# Altium project eeg.PrjPcb
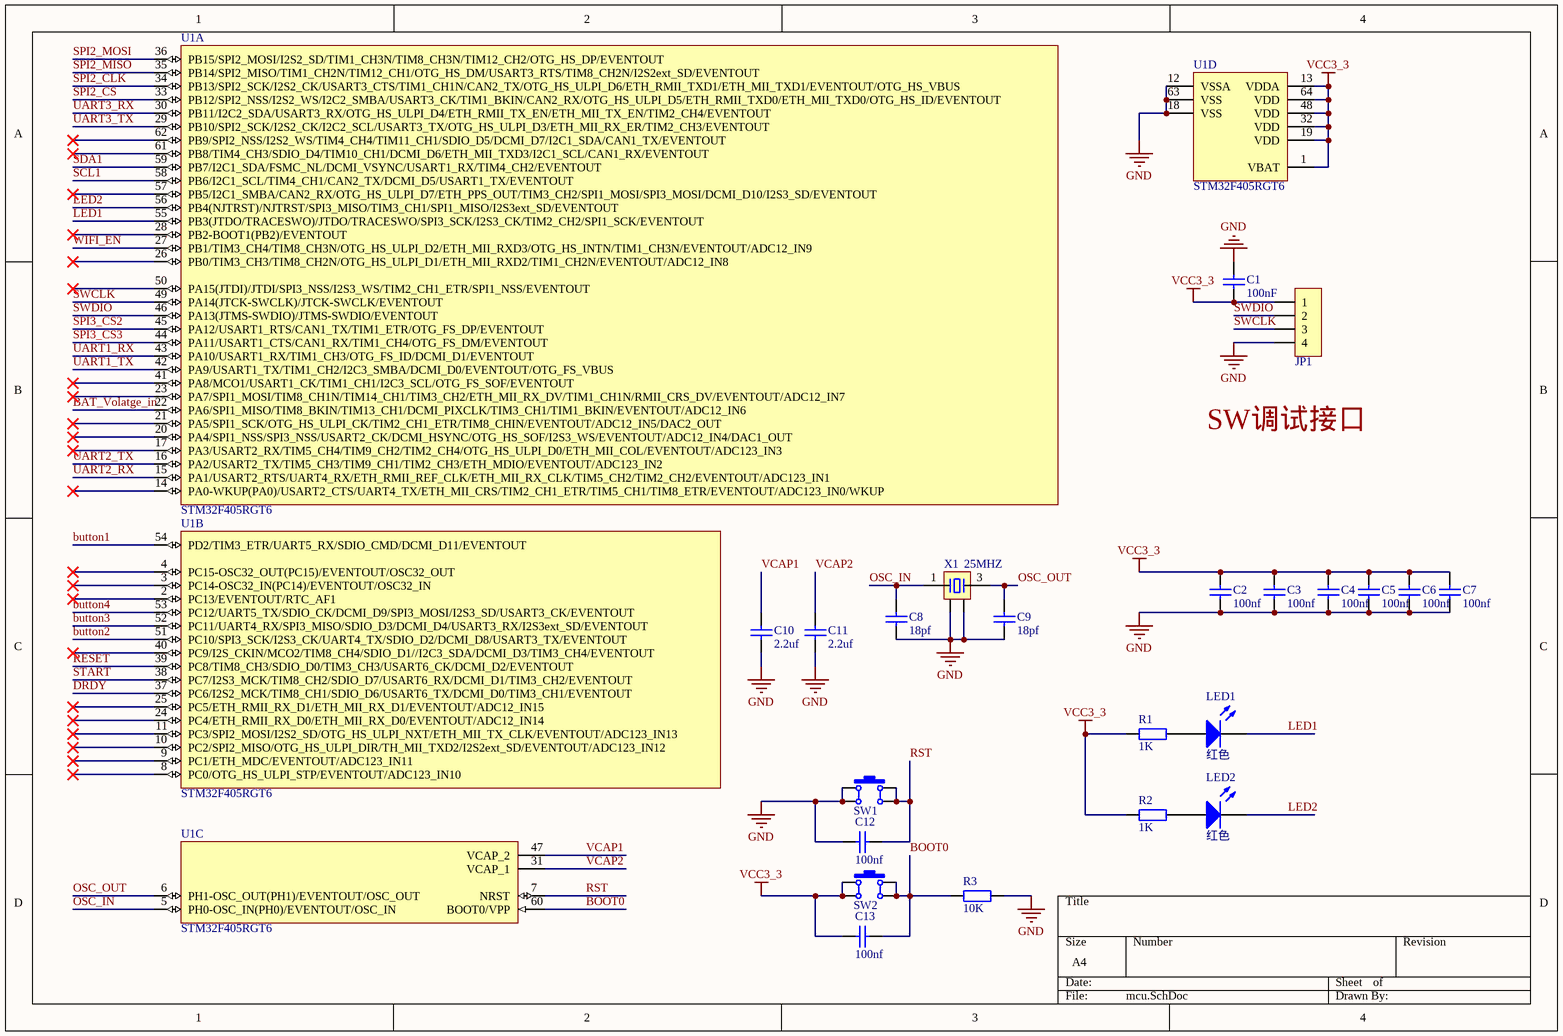
[diagram p0: mcu.SchDoc]
3 sheets, 86 parts. Net scope: global (net labels, ports and power ports of the same name join across sheets).
Board file: eeg.PcbDoc
Sheets:
  mcu.SchDoc
  power_battery.SchDoc
  communication.SchDoc

## Sheet mcu.SchDoc
size A4; SheetNumber: 1; SheetTotal: 4

### Parts
C1  100nF  [C0603_L]
C2  100nf  [C0402_L]
C3  100nf  [C0402_L]
C4  100nf  [C0402_L]
C5  100nf  [C0402_L]
C6  100nf  [C0402_L]
C7  100nf  [C0402_L]
C8  18pf  [C0402_L]
C9  18pf  [C0402_L]
C10  2.2uf  [C0402_L]
C11  2.2uf  [C0402_L]
C12  100nf  [C0603_L]
C13  100nf  [C0603_L]
JP1  HDR-1X4  [XH2.54-WI-4P]  (value not drawn)
LED1  红色  [LED0603_Y]
LED2  红色  [LED0603_Y]
R1  1K  [R0603_L]
R2  1K  [R0603_L]
R3  10K  [R0603_L]
SW1  3*4*2.5  [SW-SMD-4.2x3.2_4P]  (value not drawn)
SW2  3*4*2.5  [SW-SMD-4.2x3.2_4P]  (value not drawn)
U1  STM32F405RGT6  [TQFP64_V]  (parts A,B,C,D of 4)
X1  25MHZ  [XTAL-3225-4P]

### Nets
GND: C1.2 C2.1 C3.1 C4.1 C5.1 C6.1 C7.1 C8.1 C9.1 C10.1 C11.1 C12.2 JP1.4 R3.2 SW1.1 SW1.4 U1.12(VSSA) U1.18(VSS) U1.63(VSS) X1.2 X1.4
VCC3_3: C1.1 C2.2 C3.2 C4.2 C5.2 C6.2 C7.2 C13.2 JP1.1 R1.1 R2.1 SW2.1 SW2.4 U1.1(VBAT) U1.13(VDDA) U1.19(VDD) U1.32(VDD) U1.48(VDD) U1.64(VDD)
BAT_Volatge_in: U1.22(PA6/SPI1_MISO/TIM8_BKIN/TIM13_CH1/DCMI_PIXCLK/TIM3_CH1/TIM1_BKIN/EVENTOUT/ADC12_IN6)
BOOT0: C13.1 R3.1 SW2.2 SW2.3 U1.60(BOOT0/VPP)
button1: U1.54(PD2/TIM3_ETR/UART5_RX/SDIO_CMD/DCMI_D11/EVENTOUT)
button2: U1.51(PC10/SPI3_SCK/I2S3_CK/UART4_TX/SDIO_D2/DCMI_D8/USART3_TX/EVENTOUT)
button3: U1.52(PC11/UART4_RX/SPI3_MISO/SDIO_D3/DCMI_D4/USART3_RX/I2S3ext_SD/EVENTOUT)
button4: U1.53(PC12/UART5_TX/SDIO_CK/DCMI_D9/SPI3_MOSI/I2S3_SD/USART3_CK/EVENTOUT)
DRDY: U1.37(PC6/I2S2_MCK/TIM8_CH1/SDIO_D6/USART6_TX/DCMI_D0/TIM3_CH1/EVENTOUT)
LED1: LED1.2(K) U1.55(PB3(JTDO/TRACESWO)/JTDO/TRACESWO/SPI3_SCK/I2S3_CK/TIM2_CH2/SPI1_SCK/EVENTOUT)
LED2: LED2.2(K) U1.56(PB4(NJTRST)/NJTRST/SPI3_MISO/TIM3_CH1/SPI1_MISO/I2S3ext_SD/EVENTOUT)
OSC_IN: C8.2 U1.5(PH0-OSC_IN(PH0)/EVENTOUT/OSC_IN) X1.1
OSC_OUT: C9.2 U1.6(PH1-OSC_OUT(PH1)/EVENTOUT/OSC_OUT) X1.3
RESET: U1.39(PC8/TIM8_CH3/SDIO_D0/TIM3_CH3/USART6_CK/DCMI_D2/EVENTOUT)
RST: C12.1 SW1.2 SW1.3 U1.7(NRST)
SCL1: U1.58(PB6/I2C1_SCL/TIM4_CH1/CAN2_TX/DCMI_D5/USART1_TX/EVENTOUT)
SDA1: U1.59(PB7/I2C1_SDA/FSMC_NL/DCMI_VSYNC/USART1_RX/TIM4_CH2/EVENTOUT)
SPI2_CLK: U1.34(PB13/SPI2_SCK/I2S2_CK/USART3_CTS/TIM1_CH1N/CAN2_TX/OTG_HS_ULPI_D6/ETH_RMII_TXD1/ETH_MII_TXD1/EVENTOUT/OTG_HS_VBUS)
SPI2_CS: U1.33(PB12/SPI2_NSS/I2S2_WS/I2C2_SMBA/USART3_CK/TIM1_BKIN/CAN2_RX/OTG_HS_ULPI_D5/ETH_RMII_TXD0/ETH_MII_TXD0/OTG_HS_ID/EVENTOUT)
SPI2_MISO: U1.35(PB14/SPI2_MISO/TIM1_CH2N/TIM12_CH1/OTG_HS_DM/USART3_RTS/TIM8_CH2N/I2S2ext_SD/EVENTOUT)
SPI2_MOSI: U1.36(PB15/SPI2_MOSI/I2S2_SD/TIM1_CH3N/TIM8_CH3N/TIM12_CH2/OTG_HS_DP/EVENTOUT)
SPI3_CS2: U1.45(PA12/USART1_RTS/CAN1_TX/TIM1_ETR/OTG_FS_DP/EVENTOUT)
SPI3_CS3: U1.44(PA11/USART1_CTS/CAN1_RX/TIM1_CH4/OTG_FS_DM/EVENTOUT)
START: U1.38(PC7/I2S3_MCK/TIM8_CH2/SDIO_D7/USART6_RX/DCMI_D1/TIM3_CH2/EVENTOUT)
SWCLK: JP1.3 U1.49(PA14(JTCK-SWCLK)/JTCK-SWCLK/EVENTOUT)
SWDIO: JP1.2 U1.46(PA13(JTMS-SWDIO)/JTMS-SWDIO/EVENTOUT)
UART1_RX: U1.43(PA10/USART1_RX/TIM1_CH3/OTG_FS_ID/DCMI_D1/EVENTOUT)
UART1_TX: U1.42(PA9/USART1_TX/TIM1_CH2/I2C3_SMBA/DCMI_D0/EVENTOUT/OTG_FS_VBUS)
UART2_RX: U1.15(PA1/USART2_RTS/UART4_RX/ETH_RMII_REF_CLK/ETH_MII_RX_CLK/TIM5_CH2/TIM2_CH2/EVENTOUT/ADC123_IN1)
UART2_TX: U1.16(PA2/USART2_TX/TIM5_CH3/TIM9_CH1/TIM2_CH3/ETH_MDIO/EVENTOUT/ADC123_IN2)
UART3_RX: U1.30(PB11/I2C2_SDA/USART3_RX/OTG_HS_ULPI_D4/ETH_RMII_TX_EN/ETH_MII_TX_EN/TIM2_CH4/EVENTOUT)
UART3_TX: U1.29(PB10/SPI2_SCK/I2S2_CK/I2C2_SCL/USART3_TX/OTG_HS_ULPI_D3/ETH_MII_RX_ER/TIM2_CH3/EVENTOUT)
VCAP1: C10.2 U1.47(VCAP_2)
VCAP2: C11.2 U1.31(VCAP_1)
WIFI_EN: U1.27(PB1/TIM3_CH4/TIM8_CH3N/OTG_HS_ULPI_D2/ETH_MII_RXD3/OTG_HS_INTN/TIM1_CH3N/EVENTOUT/ADC12_IN9)
NetLED1_1: LED1.1(A) R1.2
NetLED2_1: LED2.1(A) R2.2

Not connected (* = marked no-connect by the designer): U1 2(PC13/EVENTOUT/RTC_AF1)* 3(PC14-OSC32_IN(PC14)/EVENTOUT/OSC32_IN)* 4(PC15-OSC32_OUT(PC15)/EVENTOUT/OSC32_OUT)* 8(PC0/OTG_HS_ULPI_STP/EVENTOUT/ADC123_IN10)* 9(PC1/ETH_MDC/EVENTOUT/ADC123_IN11)* 10(PC2/SPI2_MISO/OTG_HS_ULPI_DIR/TH_MII_TXD2/I2S2ext_SD/EVENTOUT/ADC123_IN12)* 11(PC3/SPI2_MOSI/I2S2_SD/OTG_HS_ULPI_NXT/ETH_MII_TX_CLK/EVENTOUT/ADC123_IN13)* 14(PA0-WKUP(PA0)/USART2_CTS/UART4_TX/ETH_MII_CRS/TIM2_CH1_ETR/TIM5_CH1/TIM8_ETR/EVENTOUT/ADC123_IN0/WKUP)* 17(PA3/USART2_RX/TIM5_CH4/TIM9_CH2/TIM2_CH4/OTG_HS_ULPI_D0/ETH_MII_COL/EVENTOUT/ADC123_IN3)* 20(PA4/SPI1_NSS/SPI3_NSS/USART2_CK/DCMI_HSYNC/OTG_HS_SOF/I2S3_WS/EVENTOUT/ADC12_IN4/DAC1_OUT)* 21(PA5/SPI1_SCK/OTG_HS_ULPI_CK/TIM2_CH1_ETR/TIM8_CHIN/EVENTOUT/ADC12_IN5/DAC2_OUT)* 23(PA7/SPI1_MOSI/TIM8_CH1N/TIM14_CH1/TIM3_CH2/ETH_MII_RX_DV/TIM1_CH1N/RMII_CRS_DV/EVENTOUT/ADC12_IN7)* 24(PC4/ETH_RMII_RX_D0/ETH_MII_RX_D0/EVENTOUT/ADC12_IN14)* 25(PC5/ETH_RMII_RX_D1/ETH_MII_RX_D1/EVENTOUT/ADC12_IN15)* 26(PB0/TIM3_CH3/TIM8_CH2N/OTG_HS_ULPI_D1/ETH_MII_RXD2/TIM1_CH2N/EVENTOUT/ADC12_IN8)* 28(PB2-BOOT1(PB2)/EVENTOUT)* 40(PC9/I2S_CKIN/MCO2/TIM8_CH4/SDIO_D1//I2C3_SDA/DCMI_D3/TIM3_CH4/EVENTOUT)* 41(PA8/MCO1/USART1_CK/TIM1_CH1/I2C3_SCL/OTG_FS_SOF/EVENTOUT)* 50(PA15(JTDI)/JTDI/SPI3_NSS/I2S3_WS/TIM2_CH1_ETR/SPI1_NSS/EVENTOUT)* 57(PB5/I2C1_SMBA/CAN2_RX/OTG_HS_ULPI_D7/ETH_PPS_OUT/TIM3_CH2/SPI1_MOSI/SPI3_MOSI/DCMI_D10/I2S3_SD/EVENTOUT)* 61(PB8/TIM4_CH3/SDIO_D4/TIM10_CH1/DCMI_D6/ETH_MII_TXD3/I2C1_SCL/CAN1_RX/EVENTOUT)* 62(PB9/SPI2_NSS/I2S2_WS/TIM4_CH4/TIM11_CH1/SDIO_D5/DCMI_D7/I2C1_SDA/CAN1_TX/EVENTOUT)*

### Notes on the sheet
- SW调试接口

### Library data of the parts
C1-C13 = C: 贴片电容/MLCC电容; BOM名称: 无极性贴片电容; 联系下单店铺卖家 免费帮你查找封装: 联系下单店铺卖家 免费技术指导
JP1 = Header 4: 4P接插件; 联系卖家，免费查找封装: 唯一出售店铺网址https://shop463601444.taobao.com; 封装库来自淘宝卖家ID：黄晶宝石: 其他店铺购入均为盗版封装库，请立即申请退款，本店现金奖励50~200元; BOM名称: 4P接插件
LED1 LED2 = LED: 贴片LED; 封装库来自淘宝卖家：黄晶宝石: 其他店铺购入均为盗版封装库，无更新权益，请立即申请退款，本店现金奖励200~1000元; BOM名称: 贴片LED
R1-R3 = R: 贴片电阻; 联系下单店铺卖家 免费帮你查找封装: 联系下单店铺卖家 免费技术指导; BOM名称: 贴片电阻
SW1 SW2 = SW SMD-3*4*2.5: 贴片4脚轻触开关; 联系下单店铺卖家 免费技术支持: 联系下单店铺卖家 免费帮你查找封装
U1 = STM32F405RGT6: ARM Cortex-M4 32b MCU+FPU, 210DMIP, 1024 kB Flash, 192+4 kB RAM, 51 I/Os, 64-pin LQFP, -40 to +85癈, Tray; Internal RAM: 192kB; Operating Frequency (Processor Speed): 168MHz; A/D Converter: 16x12-bit; D/A Converter: 2x12-bit; 16-bit Timers (IC/OC/PWM): 12x16-bit(24/24/30); 32-bit Timer (IC/OC/PWM): 2x32-bit (8/8/8); Other Timer Functions: 2xWDG, RTC, 24-bit down counter; Serial Interface: 3xSPI/2xI2S/2xI2C/3xUSART(IrDa, ISO7816)/3xUART/1xUSB OTG FS/HS, 2xCAN/ SDIO; 当前库版本V2023.3.12 @淘宝卖家:黄晶宝石: 最新版本发布https://item.taobao.com/item.htm?id=566775463719; DatasheetVersion: rev2, Jan-2012; PackageVersion: 2012; PackageReference: TQFP64; PackageDescription: 64-Pin Low Profile Quad Flat Package, 10x10 mm Body, 0.5 mm Pitch; ComponentLink1Description: Manufacturer URL; ComponentLink1URL: http://www.st.com/; ComponentLink2Description: STM32F405/7 Datasheet; ComponentLink2URL: http://www.st.com/internet/com/TECHNICAL_RESOURCES/TECHNICAL_LITERATURE/DATASHEET/DM00037051.pdf; ComponentLink3Description: STM32F4 Web Page; ComponentLink3URL: http://www.st.com/internet/mcu/subclass/1521.jsp
X1 = XTAL-4P: 4脚无源晶振(谐振器）C9006; 联系下单店铺卖家 免费帮你查找封装: 联系下单店铺卖家 免费技术指导; BOM名称: 4脚无源晶振(谐振器）; jlc_id: C9006

## Sheet power_battery.SchDoc
size A4; SheetNumber: 3; SheetTotal: 4
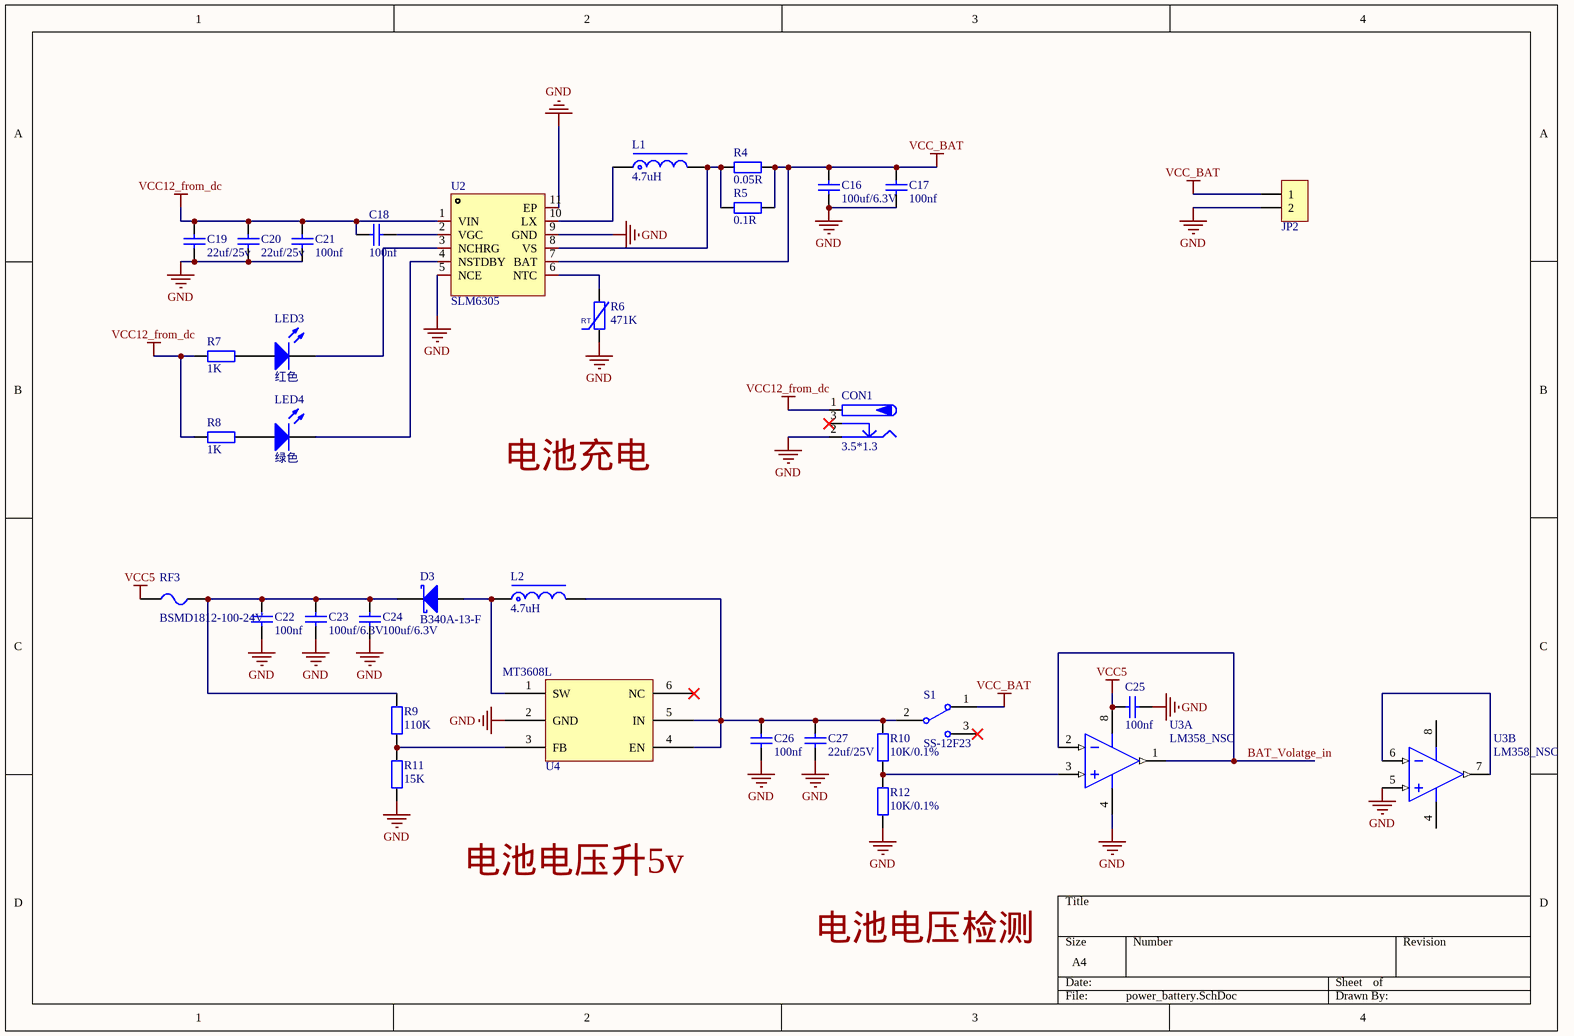
[diagram p1: power_battery.SchDoc]

### Parts
C16  100uf/6.3V  [C1206_L]
C17  100nf  [C0603_L]
C18  100nf  [C0603_L]
C19  22uf/25v  [C0805_L]
C20  22uf/25v  [C0805_L]
C21  100nf  [C0603_L]
C22  100nf  [C0603_L]
C23  100uf/6.3V  [C1206_L]
C24  100uf/6.3V  [C1206_L]
C25  100nf  [C0603_L]
C26  100nf  [C0603_L]
C27  22uf/25V  [C1206_L]
CON1  3.5*1.3  [DC-005]
D3  B340A-13-F  [SMA]
JP2  HDR-1X2  [PH2.0-L-2P]  (value not drawn)
L1  4.7uH  [CD53]
L2  4.7uH  [CD53]
LED3  红色  [LED0603_Y]
LED4  绿色  [LED0603_Y]
R4  0.05R  [R0805_M]
R5  0.1R  [R0805_M]
R6  471K  [PK0406]
R7  1K  [R0603_L]
R8  1K  [R0603_L]
R9  110K  [R0603_L]
R10  10K/0.1%  [R0603_L]
R11  15K  [R0603_L]
R12  10K/0.1%  [R0603_L]
RF3  BSMD1812-100-24V  [F1812]
S1  SS-12F23  [SS-12D10]
U2  SLM6305  [DFN10-L3.0-W3.0-P0.5_EP]
U3  LM358_NSC  [SOP8_N]  (parts A,B of 2)
U4  MT3608L  [SOT23-6M]

### Nets
GND: C16.1 C17.1 C19.1 C20.1 C21.2 C22.1 C23.1 C24.1 C25.1 C26.1 C27.1 CON1.2 JP2.2 R6.1 R11.1 R12.1 U2.5(NCE) U2.9(GND) U2.11(EP) U3.4(V-) U3.5(IN2+) U4.2(GND)
VCC5: C25.2 RF3.2 U3.8(V+)
VCC12_from_dc: C18.2 C19.2 C20.2 C21.1 CON1.1 R7.1 R8.1 U2.1(VIN)
VCC_BAT: C16.2 C17.2 JP2.1 R4.2 R5.2 S1.1 U2.7(BAT)
BAT_Volatge_in: U3.1(OUT1) U3.2(IN1-)
NetC18_1: C18.1 U2.2(VGC)
NetC22_2: C22.2 C23.2 C24.2 D3.2(K) R9.2 RF3.1
NetC26_2: C26.2 C27.2 L2.2 R10.2 S1.2 U4.4(EN) U4.5(IN)
NetD3_1: D3.1(A) L2.1 U4.1(SW)
NetL1_1: L1.1 U2.10(LX)
NetL1_2: L1.2 R4.1 R5.1 U2.8(VS)
NetLED3_1: LED3.1(A) R7.2
NetLED3_2: LED3.2(K) U2.3(NCHRG)
NetLED4_1: LED4.1(A) R8.2
NetLED4_2: LED4.2(K) U2.4(NSTDBY)
NetR6_2: R6.2 U2.6(NTC)
NetR9_1: R9.1 R11.2 U4.3(FB)
NetR10_1: R10.1 R12.2 U3.3(IN1+)
NetU3_6: U3.6(IN2-) U3.7(OUT2)

Not connected (* = marked no-connect by the designer): CON1 3*; S1 3*; U4 6(NC)*

### Notes on the sheet
- 电池充电
- 电池电压升5v
- 电池电压检测

### Library data of the parts
C16-C21 = C: as C1 on sheet mcu
  C16 C19 C20: jlc_id: C45783
C22-C27 = C: 贴片电容/MLCC电容; BOM名称: 无极性贴片电容
  C23 C24: jlc_id: C15008
CON1 = DC002~DC005: 低压DC电源接口; BOM名称: DC电源接口; 当前库版本V2024.2.3 @淘宝卖家:黄晶宝石: 最新版本发布https://item.taobao.com/item.htm?id=566775463719
D3 = B340A-13-F: 肖特基二极管 C85098; 属性: 60V/5A; BOM名称: 肖特基二极管
JP2 = Header 2: 2P接插件; 封装库来自淘宝卖家：黄晶宝石: 获取最新版本https://shop463601444.taobao.com; 联系下单店铺卖家 免费帮你查找封装: 联系下单店铺卖家 免费技术支持; BOM名称: 2P接插件
L1 L2 = L-SMD: CD系列贴片线绕功率电感; BOM名称: 功率电感; jlc_id: C177246
LED3 LED4 = LED: as LED1 on sheet mcu; BOM名称: 贴片LED
R4 R5 R7-R12 = R: 贴片电阻; 联系下单店铺卖家 免费帮你查找封装: 联系下单店铺卖家 免费技术指导; BOM名称: 贴片电阻
  R4: jlc_id: C127691
  R5: jlc_id: C25334
R6 = RT: 热敏电阻; BOM名称: 压敏电阻; 当前库版本V2024.3.30 @淘宝卖家:黄晶宝石: 最新版本发布https://item.taobao.com/item.htm?id=566775463719
RF3 = FUSE-PPTC: PPTC自恢复保险丝 C910830; 当前库版本V2024.3.30 @淘宝卖家:黄晶宝石: 最新版本发布https://item.taobao.com/item.htm?id=566775463719; BOM名称: PPTC自恢复保险丝; jlc_id: C883154
S1 = SSW-1P: 1路波动开关; BOM名称: 波动开关; 联系下单店铺卖家 免费技术支持: 联系下单店铺卖家 免费帮你查找封装
U2 = SLM6305: 1锂电池充电ic 2.5a 4.2v 4V~26V输入; Manufacturer: 无锡松朗微; Add into BOM: yes; The Chip Type: 降压充电芯片; Supply Voltage: 4V~26V; Type of Battery: 锂离子/聚合物; Number of Cells: 1; Symbol: SLM6305; Device: SLM6305; Supplier: LCSC; jlc_id: C711584; Manufacturer Part: SLM6305; JLCPCB Part Class: 扩展库; LCSC Part Name: 宽输入电压2.5A单节锂电池充电管理IC; Supplier Footprint: TDFN-10-EP(3x3); Datasheet: https://atta.szlcsc.com/upload/public/pdf/source/20200723/C711584_2224278DBAF55B7B34A102BEBD70C238.pdf; Convert to PCB: yes; Maximum Charge Current: 2.5A; Charging Saturation Voltage: 4.2V; Operating Temperature: -40℃~+85℃
U3 = LM358_NSC: Fast Settling Dual Operational Amplifier; 联系卖家 免费查找封装: 唯一出售店铺网址https://shop463601444.taobao.com; jlc_id: C2923376
U4 = MT3608L: Boost升压DC-DC芯片 2-28V

## Sheet communication.SchDoc
size A4; SheetNumber: 4; SheetTotal: 4
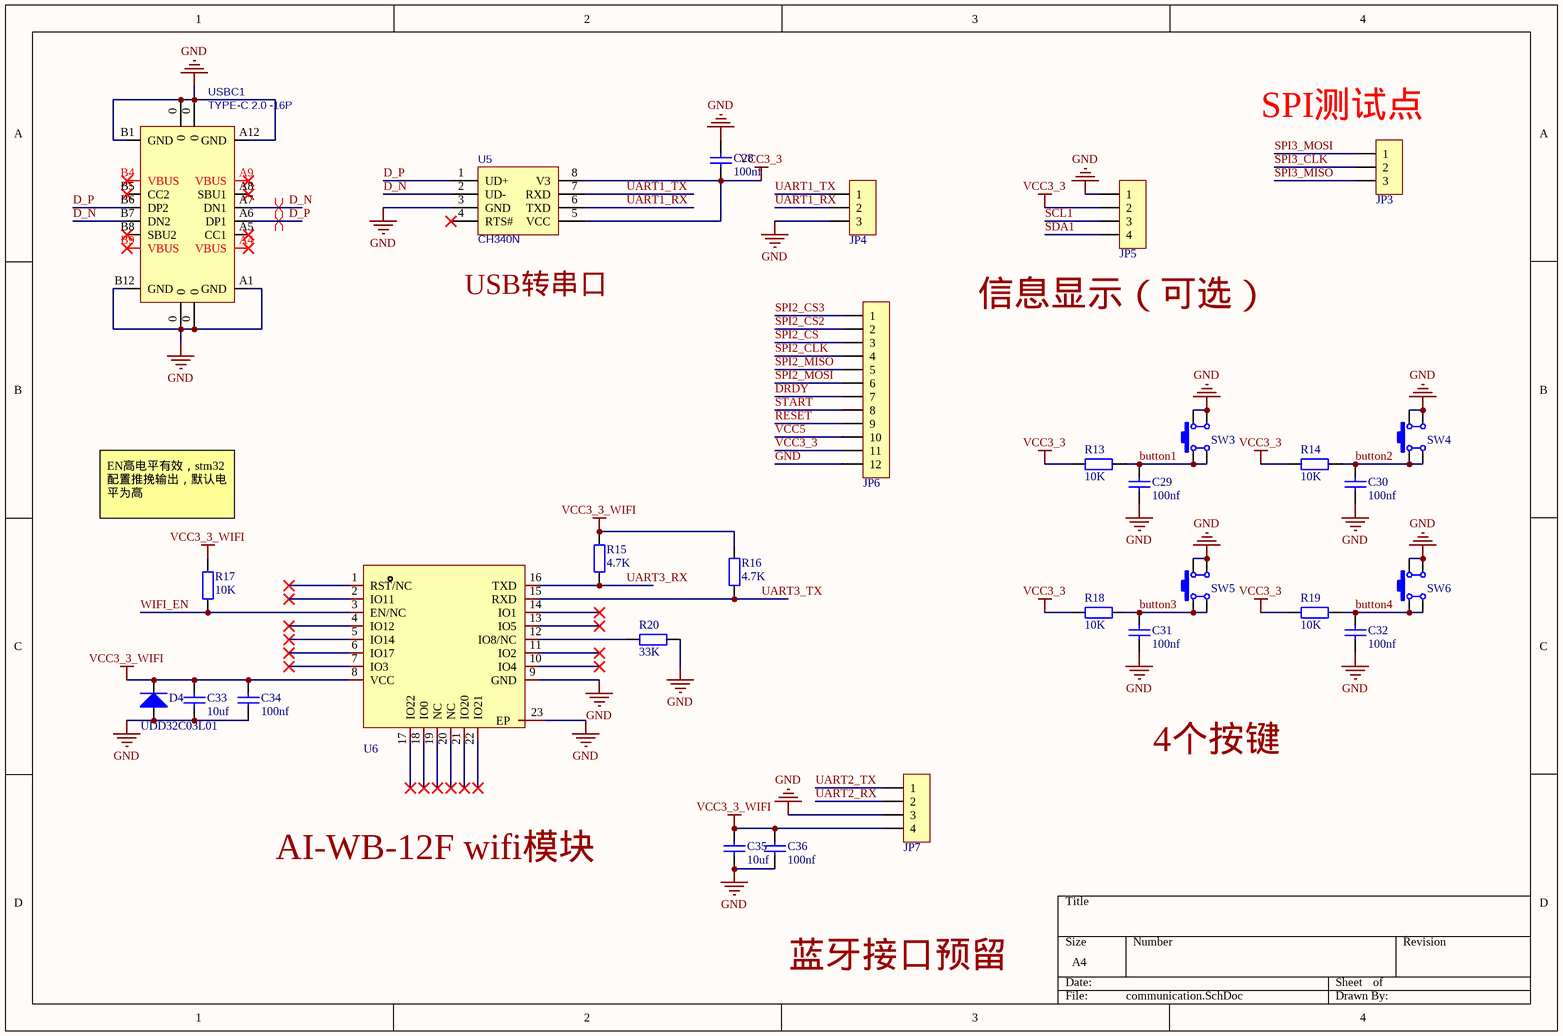
[diagram p2: communication.SchDoc]

### Parts
C28  100nf  [C0603_L]
C29  100nf  [C0603_L]
C30  100nf  [C0603_L]
C31  100nf  [C0603_L]
C32  100nf  [C0603_L]
C33  10uf  [C0603_L]
C34  100nf  [C0603_L]
C35  10uf  [C0603_L]
C36  100nf  [C0603_L]
D4  UDD32C03L01  [SOD-323]
JP3  HDR-1X3  [HDR2.54-LI-3P]  (value not drawn)
JP4  HDR-1X3  [HDR2.54-LI-3P]  (value not drawn)
JP5  HDR-1X4  [HDR2.54-M-LI-4P]  (value not drawn)
JP6  HDR-1X12  [HDR2.54-M-LI-12P]  (value not drawn)
JP7  HDR-1X4  [HDR2.54-M-LI-4P]  (value not drawn)
R13  10K  [R0603_L]
R14  10K  [R0603_L]
R15  4.7K  [R0402_L]
R16  4.7K  [R0402_L]
R17  10K  [R0402_L]
R18  10K  [R0603_L]
R19  10K  [R0603_L]
R20  33K  [R0402_L]
SW3  3*4*2.5  [SW-SMD-4.2x3.2_4P]  (value not drawn)
SW4  3*4*2.5  [SW-SMD-4.2x3.2_4P]  (value not drawn)
SW5  3*4*2.5  [SW-SMD-4.2x3.2_4P]  (value not drawn)
SW6  3*4*2.5  [SW-SMD-4.2x3.2_4P]  (value not drawn)
U5  CH340N  [SOIC-8]
U6  Ai-WB2-12F  [ai-wb-12f]  (value not drawn)
USBC1  TYPE-C 2.0 -16P  [USB-C-SMD_16P]

### Nets
GND: C28.2 C29.1 C30.1 C31.1 C32.1 C33.1 C34.1 C35.1 C36.1 D4.1(A) JP4.3 JP5.1 JP6.12 JP7.3 R20.1 SW3.2 SW3.3 SW4.2 SW4.3 SW5.2 SW5.3 SW6.2 SW6.3 U5.3(GND) U6.9(GND) U6.23(EP) USBC1.0 USBC1.A1(GND) USBC1.A12(GND) USBC1.B1(GND) USBC1.B12(GND)
VCC3_3: C28.1 JP5.2 JP6.11 R13.1 R14.1 R18.1 R19.1 U5.5(VCC) U5.8(V3)
VCC3_3_WIFI: C33.2 C34.2 C35.2 C36.2 D4.2(K) JP7.4 R15.1 R16.1 R17.2 U6.8(VCC)
VCC5: JP6.10
button1: C29.2 R13.2 SW3.1 SW3.4
button2: C30.2 R14.2 SW4.1 SW4.4
button3: C31.2 R18.2 SW5.1 SW5.4
button4: C32.2 R19.2 SW6.1 SW6.4
D_N: U5.2(UD-) USBC1.A7(DN1) USBC1.B7(DN2)
D_P: U5.1(UD+) USBC1.A6(DP1) USBC1.B6(DP2)
DRDY: JP6.7
RESET: JP6.9
SCL1: JP5.3
SDA1: JP5.4
SPI2_CLK: JP6.4
SPI2_CS: JP6.3
SPI2_CS2: JP6.2
SPI2_CS3: JP6.1
SPI2_MISO: JP6.5
SPI2_MOSI: JP6.6
SPI3_CLK: JP3.2
SPI3_MISO: JP3.3
SPI3_MOSI: JP3.1
START: JP6.8
UART1_RX: JP4.2 U5.6(TXD)
UART1_TX: JP4.1 U5.7(RXD)
UART2_RX: JP7.2
UART2_TX: JP7.1
UART3_RX: R15.2 U6.16(TXD)
UART3_TX: R16.2 U6.15(RXD)
WIFI_EN: R17.1 U6.3(EN/NC)
NetR20_2: R20.2 U6.12(IO8/NC)

Not connected (* = marked no-connect by the designer): U5 4(RTS#)*; U6 1(RST/NC)* 2(IO11)* 4(IO12)* 5(IO14)* 6(IO17)* 7(IO3)* 10(IO4)* 11(IO2)* 13(IO5)* 14(IO1)* 17(IO22)* 18(IO0)* 19(NC)* 20(NC)* 21(IO20)* 22(IO21)*; USBC1 A4(VBUS)* A5(CC1)* A8(SBU1)* A9(VBUS)* B4(VBUS)* B5(CC2)* B8(SBU2)* B9(VBUS)*

### Layout directives
differential pair: D_N, D_P

### Notes on the sheet
- (near JP3) SPI测试点
- (near U5) USB转串口
- (near JP5) 信息显示（可选）
- EN高电平有效，stm32配置推挽输出，默认电平为高
- 4个按键
- AI-WB-12F wifi模块
- 蓝牙接口预留

### Library data of the parts
C28-C36 = C: as C1 on sheet mcu
D4 = UDD32C03L01: 静电和浪涌保护 3.3V双向; jlc_id: C78439
JP3 JP4 = Header 3: 3P接插件; 联系卖家，免费查找封装: 唯一出售店铺网址https://shop463601444.taobao.com; 封装库来自淘宝卖家ID：黄晶宝石: 其他店铺购入均为盗版封装库，请立即申请退款，本店现金奖励50~200元; BOM名称: 3P接插件
JP5 JP7 = Header 4: as JP1 on sheet mcu; BOM名称: 4P接插件
JP6 = Header 12: 12P接插件; 联系卖家，免费查找封装: 唯一出售店铺网址https://shop463601444.taobao.com; 封装库来自淘宝卖家ID：黄晶宝石: 其他店铺购入均为盗版封装库，请立即申请退款，本店现金奖励50~200元; BOM名称: 12P接插件
R13-R20 = R: 贴片电阻; 联系下单店铺卖家 免费帮你查找封装: 联系下单店铺卖家 免费技术指导; BOM名称: 贴片电阻
SW3-SW6 = SW SMD-3*4*2.5: as SW1 on sheet mcu
U5 = CH340N: USB转串口芯片, 内置晶振; 封装库来自淘宝卖家：黄晶宝石: 其他店铺购入均为盗版封装库，无更新权益，请立即申请退款，联系卖家：黄晶宝石 获取现金奖励200~5000元
U6 = Ai-WB2-12F: esp32-12f的替代 2.4g wifi和蓝牙; Manufacturer: Ai-Thinker(安信可); Add into BOM: yes; Core Processor: BL602芯片; Wireless Standard: 802.11b/g/n；BLE5.0; Support Interface: I2C；GPIO；UART；PWM；SPI；ADC; Value: 2.4GHz; Antenna Type: 板载PCB天线; Output Power: 16dBm; Operating Voltage: 3.3V; Receive  Current: 65mA; Send  Current: 260mA; Sensitivity: -98dBm; Symbol: AI-WB2-12F; Device: Ai-WB2-12F; LCSC Part Name: Ai- WB2- 12F; Supplier Part: C5187541; Manufacturer Part: Ai-WB2-12F; Supplier Footprint: SMD-22P; JLCPCB Part Class: 扩展库; Datasheet: https://atta.szlcsc.com/upload/public/pdf/source/20221011/A82852E3370C90F4DD91995C889100A2.pdf; Supplier: LCSC; Convert to PCB: yes; Operating Temperature: -40℃~+85℃
USBC1 = USB2.0_Type-C_16Pin: USB2.0_Type-C_16Pin母座 C2765186; 当前库版本V2024.2.3 @淘宝卖家:黄晶宝石: 最新版本发布https://item.taobao.com/item.htm?id=566775463719

## Nets that join several sheets
GND: mcu (21 pins), power_battery (22 pins), communication (31 pins)
VCC3_3: mcu (19 pins), communication (9 pins)
VCC5: power_battery (C25.2 RF3.2 U3.8), communication (JP6.10)
BAT_Volatge_in: mcu (U1.22), power_battery (U3.1 U3.2)
button1: mcu (U1.54), communication (C29.2 R13.2 SW3.1 SW3.4)
button2: mcu (U1.51), communication (C30.2 R14.2 SW4.1 SW4.4)
button3: mcu (U1.52), communication (C31.2 R18.2 SW5.1 SW5.4)
button4: mcu (U1.53), communication (C32.2 R19.2 SW6.1 SW6.4)
DRDY: mcu (U1.37), communication (JP6.7)
RESET: mcu (U1.39), communication (JP6.9)
SCL1: mcu (U1.58), communication (JP5.3)
SDA1: mcu (U1.59), communication (JP5.4)
SPI2_CLK: mcu (U1.34), communication (JP6.4)
SPI2_CS: mcu (U1.33), communication (JP6.3)
SPI2_MISO: mcu (U1.35), communication (JP6.5)
SPI2_MOSI: mcu (U1.36), communication (JP6.6)
START: mcu (U1.38), communication (JP6.8)
UART1_RX: mcu (U1.43), communication (JP4.2 U5.6)
UART1_TX: mcu (U1.42), communication (JP4.1 U5.7)
UART2_RX: mcu (U1.15), communication (JP7.2)
UART2_TX: mcu (U1.16), communication (JP7.1)
UART3_RX: mcu (U1.30), communication (R15.2 U6.16)
UART3_TX: mcu (U1.29), communication (R16.2 U6.15)
WIFI_EN: mcu (U1.27), communication (R17.1 U6.3)